# EAGLE design Breakout board ESP8266-012F HW 2.0 Rev. 1 (EAGLE 8.2.1)
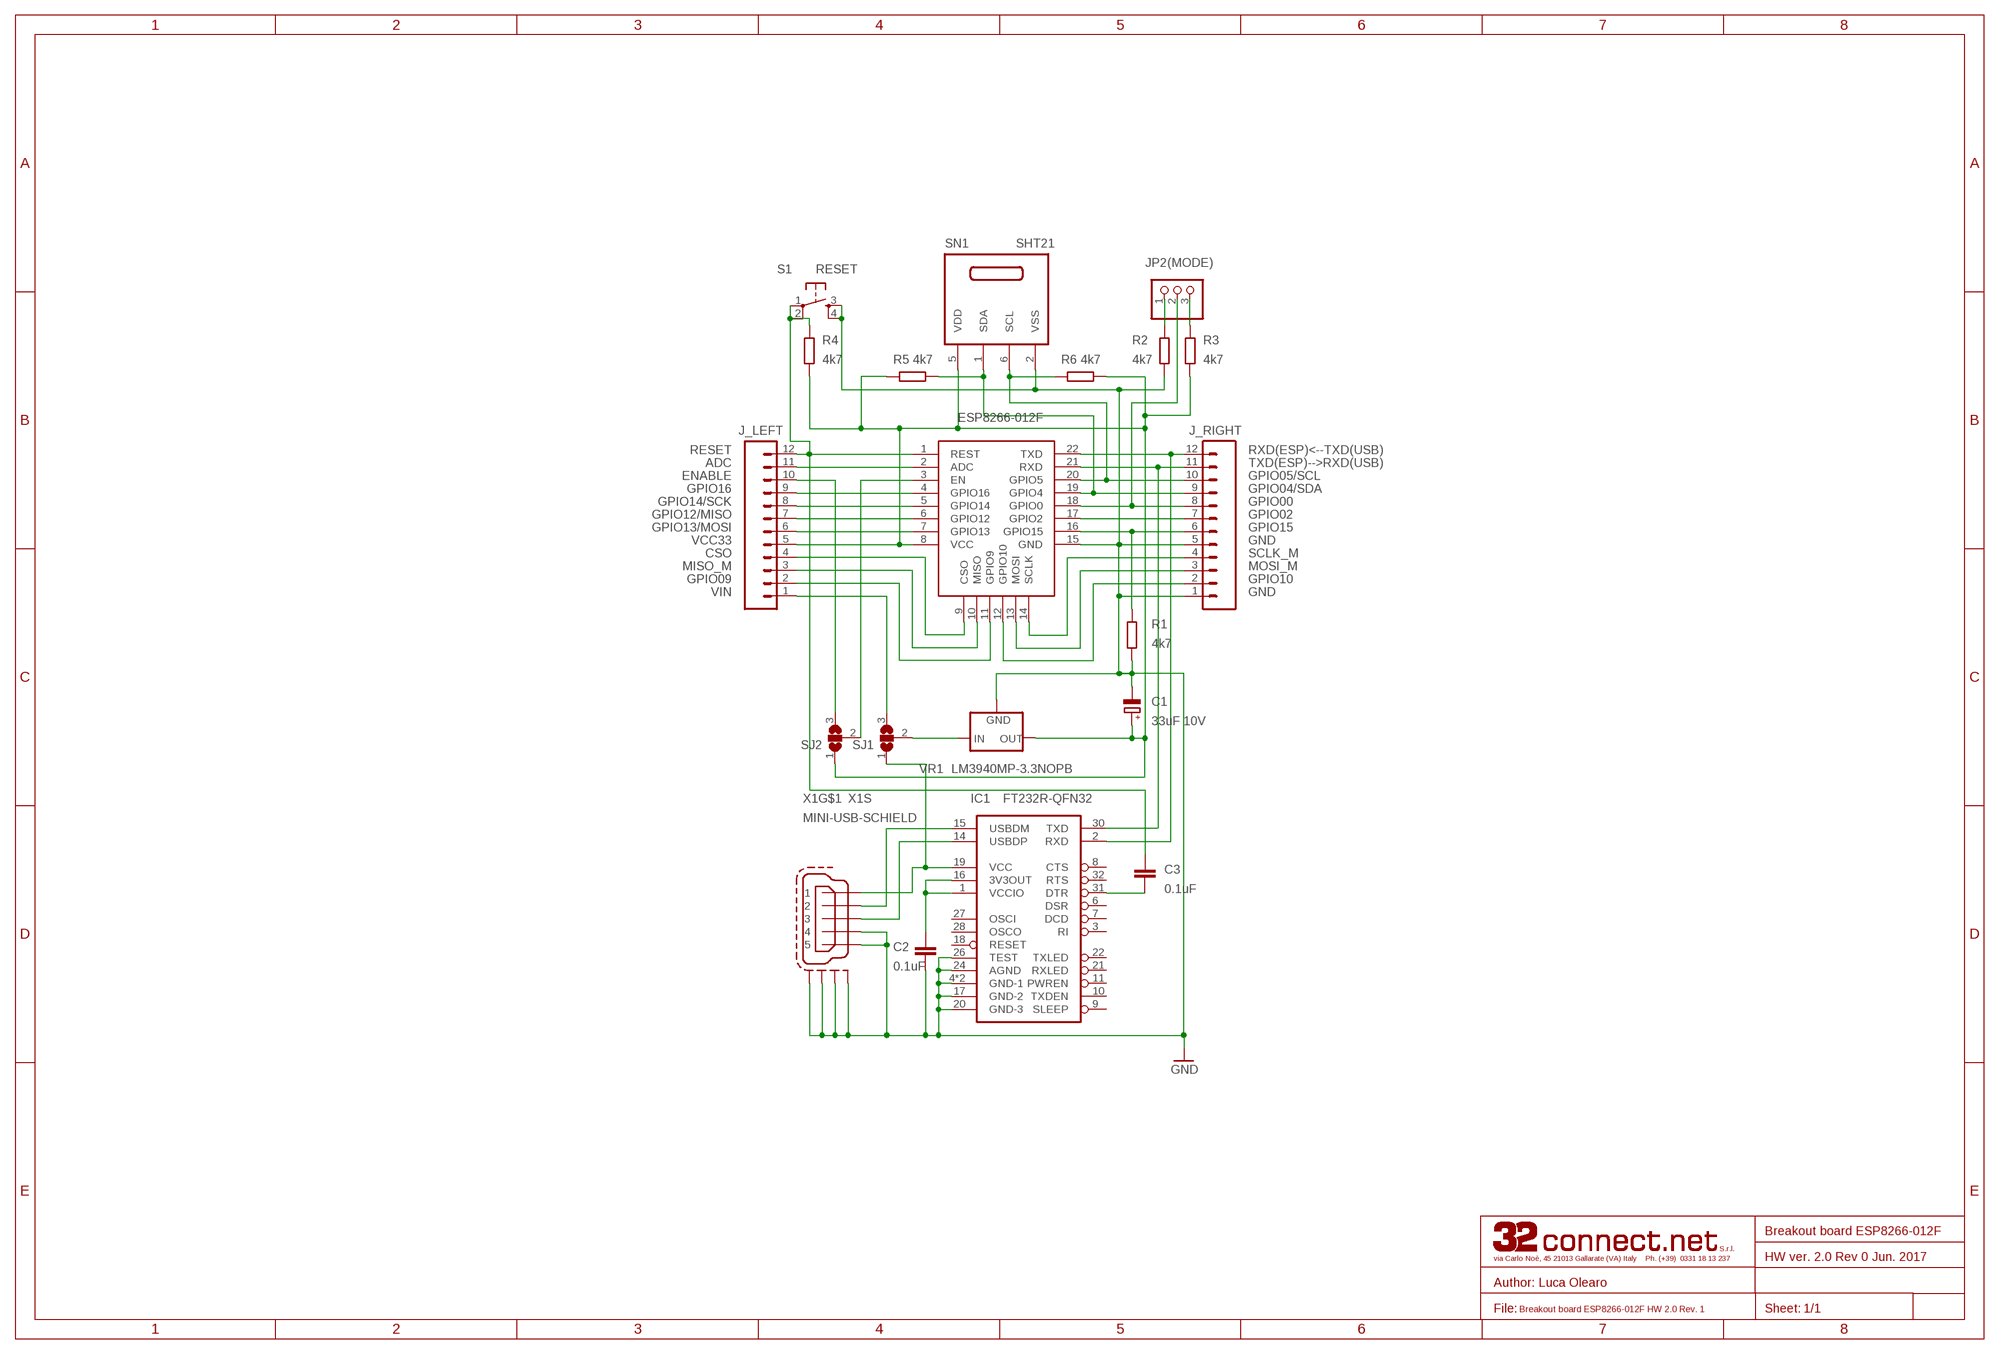
[diagram p0: schematic, sheet 1]

## Parts
C1  33uF 10V  CPOL-EUUD-5X5,8  [UD-5X5,8_NICHICON]
C2  0.1uF  C-EUC0805  [C0805]
C3  0.1uF  C-EUC0805  [C0805]
IC1  FT232R-QFN32  [QFN32]
J_LEFT  M12LONGPADS  [1X12_LONGPADS]
J_RIGHT  M12LONGPADS  [1X12_LONGPADS]
JP2(MODE)  PINHD-1X3  [1X03]
MDL1  ESP8266-012F  ESP8266-12GPIO04/05_CORRECTED  [ESP8266-ESP12]
R1  4k7  R-EU_R0805  [R0805]
R2  4k7  R-EU_R0805  [R0805]
R3  4k7  R-EU_R0805  [R0805]
R4  4k7  R-EU_R0805  [R0805]
R5  4k7  R-EU_R0805  [R0805]
R6  4k7  R-EU_R0805  [R0805]
S1  RESET  TAC_SWITCH4  [C&K_KMS]
SJ1  SJ2W  [SJ_2]
SJ2  SJ2W  [SJ_2]
SN1  SHT21  [DFN6/SHT]
VR1  LM3940MP-3.3NOPB  [SOT223]
X1  MINI-USB-SCHIELD  MINI-USB-SCHIELD--  [MOLEX_67503-X20]

## Nets
ADC: J_LEFT.11 MDL1.2(ADC)
CSO: J_LEFT.4 MDL1.9(CSO)
D+: IC1.14(USBDP) X1.3
D-: IC1.15(USBDM) X1.2
ENABLE: J_LEFT.10 SJ2.3
GND: C1.- C2.2 IC1.4(GND-1) IC1.17(GND-2) IC1.20(GND-3) IC1.24(AGND) IC1.26(TEST) IC1.EXP(GND-1) J_RIGHT.1 J_RIGHT.5 MDL1.15(GND) R1.2 R2.2 S1.3 S1.4 SN1.2(VSS) VR1.2(GND) VR1.4(GND) X1.4 X1.5 X1.M1(S:S1) X1.M2(S:S2) X1.M3(S:S3) X1.M4(S:S4)
GPIO00: J_RIGHT.8 JP2(MODE).2 MDL1.18(GPIO0)
GPIO02: J_RIGHT.7 MDL1.17(GPIO2)
GPIO04/SDA: J_RIGHT.9 MDL1.19(GPIO4) R5.2 SN1.1(SDA)
GPIO05/SCL: J_RIGHT.10 MDL1.20(GPIO5) R6.1 SN1.6(SCL)
GPIO09: J_LEFT.2 MDL1.11(GPIO9)
GPIO10: J_RIGHT.2 MDL1.12(GPIO10)
GPIO12/MISO: J_LEFT.7 MDL1.6(GPIO12)
GPIO13/MOSI: J_LEFT.6 MDL1.7(GPIO13)
GPIO14/SCK: J_LEFT.8 MDL1.5(GPIO14)
GPIO15: J_RIGHT.6 MDL1.16(GPIO15) R1.1
GPIO16: J_LEFT.9 MDL1.4(GPIO16)
MISO_M: J_LEFT.3 MDL1.10(MISO)
MOSI_M: J_RIGHT.3 MDL1.13(MOSI)
N$2: SJ1.2 VR1.1(IN)
N$3: C3.2 IC1.31(DTR)
N$4: MDL1.3(EN) SJ2.2
N$6: C2.1 IC1.1(VCCIO) IC1.16(3V3OUT)
N$9: JP2(MODE).3 R3.1
N$10: JP2(MODE).1 R2.1
RESET: C3.1 J_LEFT.12 MDL1.1(REST) R4.1 S1.1 S1.2
RXD(ESP)<--TXD(USB): IC1.2(RXD) J_RIGHT.12 MDL1.22(TXD)
SCLK_M: J_RIGHT.4 MDL1.14(SCLK)
TXD(ESP)-->RXD(USB): IC1.30(TXD) J_RIGHT.11 MDL1.21(RXD)
VBUS: IC1.19(VCC) SJ1.1 X1.1
VCC33: C1.+ J_LEFT.5 MDL1.8(VCC) R3.2 R4.2 R5.1 R6.2 SJ2.1 SN1.5(VDD) VR1.3(OUT)
VIN: J_LEFT.1 SJ1.3
Unconnected: IC1.3(RI) IC1.6(DSR) IC1.7(DCD) IC1.8(CTS) IC1.9(SLEEP) IC1.10(TXDEN) IC1.11(PWREN) IC1.18(RESET) IC1.21(RXLED) IC1.22(TXLED) IC1.27(OSCI) IC1.28(OSCO) IC1.32(RTS)

## Notes on the sheet
- Breakout board ESP8266-012F
- HW ver. 2.0 Rev 0 Jun. 2017

## Library data of the parts
C1 = rcl:CPOL-EU: POLARIZED CAPACITOR, European symbol
C2 C3 = rcl:C-EU: CAPACITOR, European symbol
IC1 = Multiconnect_base:FT232R: USB UART FT232RL 4th Generation USB UART (USB <-> Serial) Controller. Spark Fun Electronics SKU : COM-00650 Production SKU IC-00870
J_LEFT J_RIGHT = SparkFun-Connectors:M12: Header 12 Standard 12-pin 0.1" header. Use with straight break away headers (SKU : PRT-00116), right angle break away headers (PRT-00553), swiss pins (PRT-00743), machine pins (PRT-00117), and female headers (PRT-00115).
JP2(MODE) = pinhead:PINHD-1X3: PIN HEADER
MDL1 = ESP8266 EAGLE LIBRARY:ESP8266-12: Espressif ESP8266 ESP-12 Module with GPIO04 and GPIO05 corrected.
R1-R6 = rcl:R-EU_: RESISTOR, European symbol
S1 = Multiconnect_base:TAC_SWITCH: Momentary Switch
SJ1 SJ2 = Multiconnect_base:SJ2W: SMD solder JUMPER
SN1 = sensirion:SHT21: Humidity and Temperature Sensor
VR1 = Multiconnect_base:LM3940MP-3.3NOPB: MIC2920A (http://www.micrel.com/_PDF/mic2920.pdf) - 400mA output LDO Regulator
X1 = con-cypressindustries:MINI-USB-SCHIELD-: MINI USB-B Conector Source: www.cypressindustries.com

## Net classes
0 default: width 0.203 mm, clearance 0.152 mm

## Board
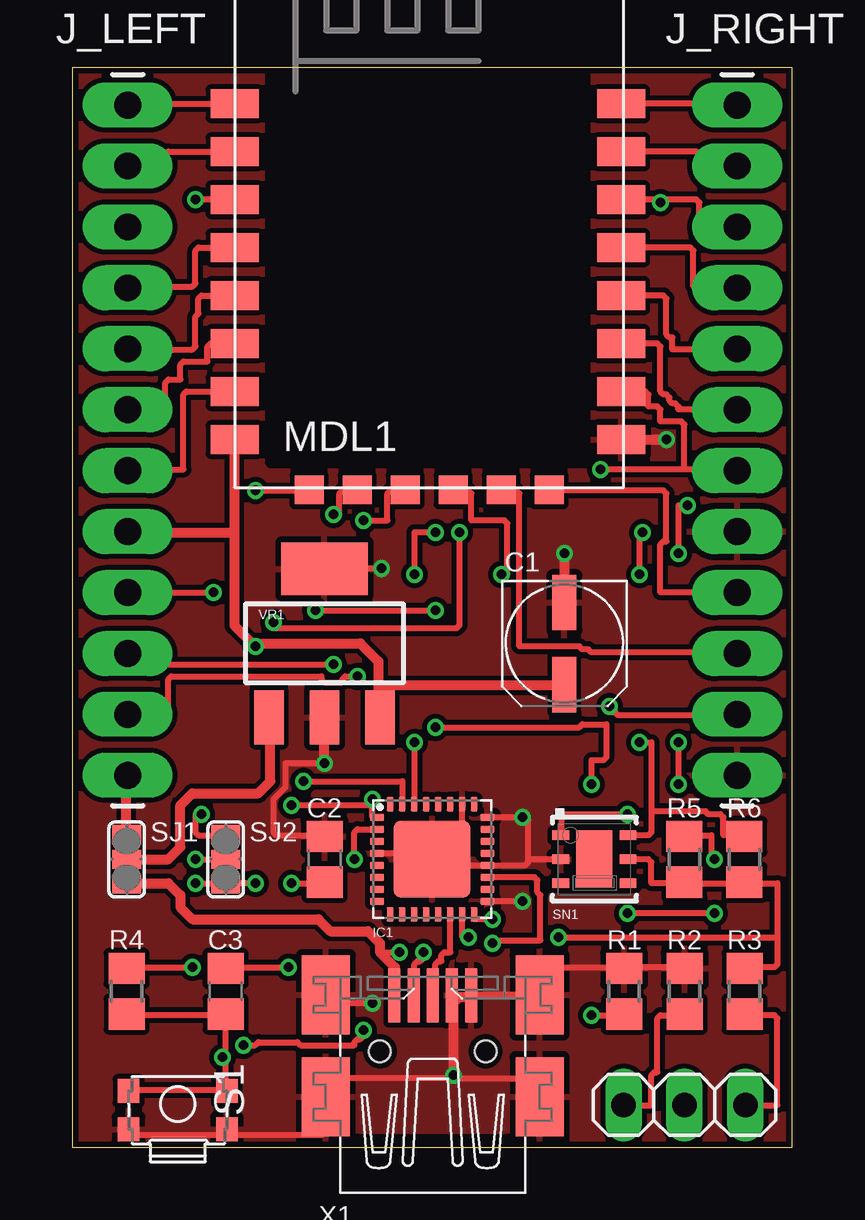
[diagram p1: board, top side]
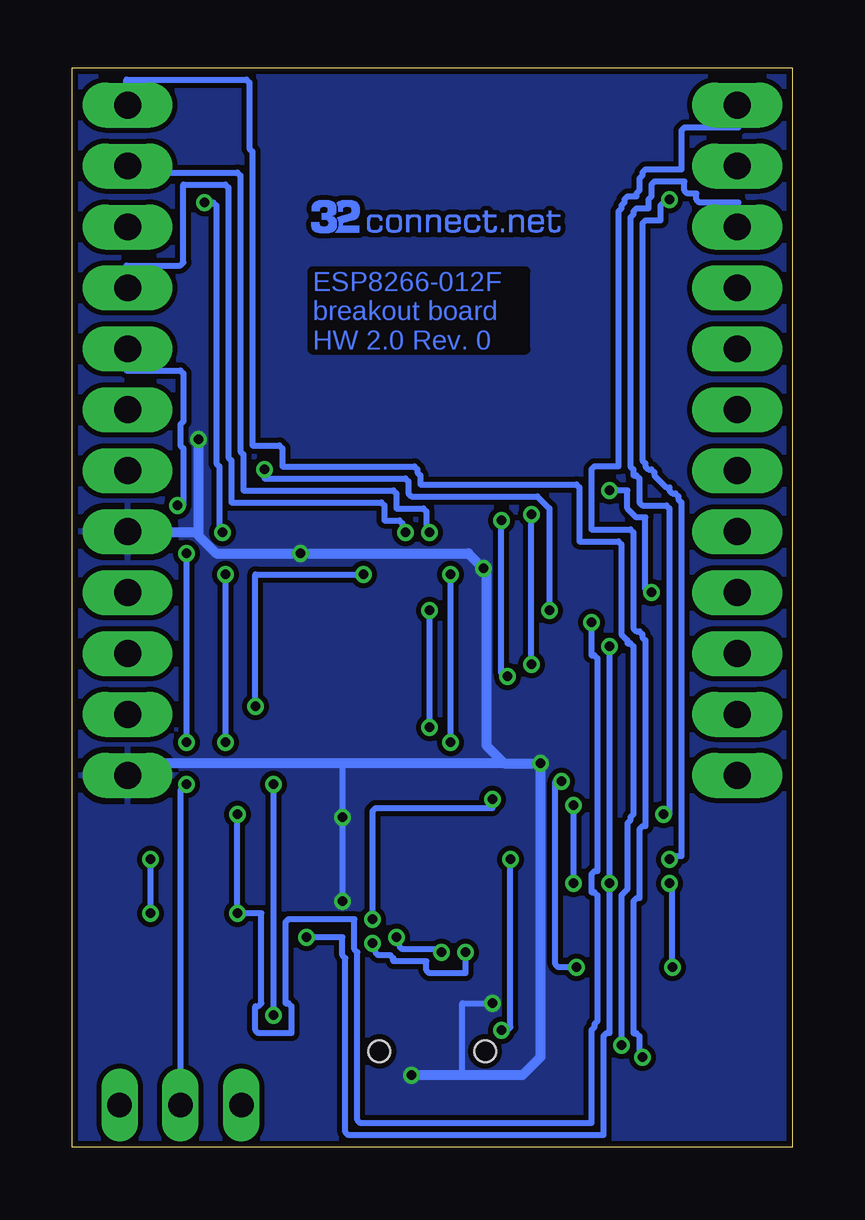
[diagram p2: board, bottom side, seen from below]

Size 30 x 45 mm. Coordinates in mm from the lower left corner, seen from the top.
Outline: 30,0 30,45 0,45 0,0 30,0
Copper layers (1*16): Top 0.035mm / dielectric 1.5mm / Bottom 0.035mm
Design rules "default *": minimum track width 10mil, minimum drill 0.4mm, track to track 8mil, track to pad 8mil, pad to pad 8mil, via to via 8mil, smd to smd 8mil, copper to edge 10mil, drill to drill 8mil, minimum pad ring 8mil, minimum via ring 6mil, stop-mask expansion 4mil, vias tented up to drill 0mil, thermal gap 10mil
tRestrict: area 8.2,28.5 to 21.4,44.9

### Footprints (pad centres in the part's own frame; a part is rotated, then mirrored left to right if it is on the bottom)
UD-5X5,8_NICHICON = smd 2.3 x 1: + 1.725,0; - -1.7,0
C0805 = smd 1.3 x 1.5: 1 -0.95,0; 2 0.95,0
QFN32 = smd 0.6 x 0.3: 1 -2.3,1.75; 2 -2.3,1.25; 3 -2.3,0.75; 4 -2.3,0.25; 5 -2.3,-0.25; 6 -2.3,-0.75; 7 -2.3,-1.25; 8 -2.3,-1.75; 17 2.3,-1.75; 18 2.3,-1.25; 19 2.3,-0.75; 20 2.3,-0.25; 21 2.3,0.25; 22 2.3,0.75; 23 2.3,1.25; 24 2.3,1.75 | smd 0.3 x 0.6: 9 -1.75,-2.3; 10 -1.25,-2.3; 11 -0.75,-2.3; 12 -0.25,-2.3; 13 0.25,-2.3; 14 0.75,-2.3; 15 1.25,-2.3; 16 1.75,-2.3; 25 1.75,2.3; 26 1.25,2.3; 27 0.75,2.3; 28 0.25,2.3; 29 -0.25,2.3; 30 -0.75,2.3; 31 -1.25,2.3; 32 -1.75,2.3 | smd 3.2 x 3.2: EXP 0,0
1X12_LONGPADS = drill 1.118 pad 1.88 long: 1 0,0; 2 2.54,0; 3 5.08,0; 4 7.62,0; 5 10.16,0; 6 12.7,0; 7 15.24,0; 8 17.78,0; 9 20.32,0; 10 22.86,0; 11 25.4,0; 12 27.94,0
1X03 = drill 1.016 long: 1 -2.54,0; 2 0,0; 3 2.54,0
ESP8266-ESP12 = smd 2 x 1.2: 1 0,16; 2 0,14; 3 0,12; 4 0,10; 5 0,8; 6 0,6; 7 0,4; 8 0,2; 15 16.1,2; 16 16.1,4; 17 16.1,6; 18 16.1,8; 19 16.1,10; 20 16.1,12; 21 16.1,14; 22 16.1,16 | smd 1.2 x 1.2: 9 3.1,-0.1; 10 5.1,-0.1; 11 7.1,-0.1; 12 9.1,-0.1; 13 11.1,-0.1; 14 13.1,-0.1
R0805 = smd 1.3 x 1.5: 1 -0.95,0; 2 0.95,0
C&K_KMS = smd 0.9 x 1: 1 0.45,2.1; 2 4.55,2.1; 3 0.45,0.5; 4 4.55,0.5
SJ_2 = smd 0.8 x 1.2: 1 -1.024,0; 2 0,0; 3 1.024,0
DFN6/SHT = smd 0.4 x 0.7: 1 -1,-1.4; 2 0,-1.4; 3 1,-1.4; 4 1,1.4; 5 0,1.4; 6 -1,1.4 | smd 2.4 x 1.5: NC 0,0
SOT223 = smd 1.219 x 2.235: 1 -2.311,-3.099; 2 0,-3.099; 3 2.311,-3.099 | smd 3.6 x 2.2: 4 0,3.099
MOLEX_67503-X20 = smd 2.25 x 0.5: 1 2.325,1.6; 2 2.325,0.8; 3 2.325,0; 4 2.325,-0.8; 5 2.325,-1.6 | smd 3.3 x 2: M1 -1.9,-4.45; M2 -1.9,4.45; M3 2.35,4.45; M4 2.35,-4.45 | hole 0.9: 0,2.2; 0,-2.2

### Placement (x,y rotation side)
C1  20.5,21 270 top
C2  10.51,12 90 top
C3  6.38,6.5 90 top
IC1  14.99,12 0 top
J_LEFT  2.3,15.5 90 top
J_RIGHT  27.7,15.5 90 top
JP2(MODE)  25.5,1.76 0 top
MDL1  6.76,27.5 0 top
R1  22.99,6.5 90 top
R2  25.51,6.5 90 top
R3  28.01,6.5 90 top
R4  2.26,6.5 90 top
R5  25.5,12 90 top
R6  28,12 270 top
S1  1.89,0.25 0 top
SJ1  2.26,12 90 top
SJ2  6.38,12 90 top
SN1  21.75,12 270 top
VR1  10.5,21.01 0 top
X1  15.01,4 90 top

### Tracks (layer width: path | path; a pad name or v marks a point on that pad's centre or on a via)
ADC
  Top 0.254: MDL1.2 4,41.5 3.88,41.38 3.88,40.88 2.38,40.88 J_LEFT.11
CSO  (via drill 0.4)
  Top 0.254: v7.62,27.38 9.75,27.38 MDL1.9 | v5.88,23.12 2.38,23.12 J_LEFT.4
  Bottom 0.254: v7.62,27.38 6.88,27.38 6.88,26.62 6.5,26.25 6.12,26.25 6.12,23.25 6,23.12 v5.88,23.12
D+
  Top 0.254: IC1.14 15.75,9.62 15.75,8.12 15.5,8.12 15.38,8 15.38,7.75 15.25,7.75 15.12,7.62 15.12,7.25 15,7.12 15,6.38 X1.3
D-  (via drill 0.4)
  Top 0.254: v16.5,8.75 16.25,8.75 16.25,9.62 IC1.15 | v14.62,8.12 14.62,7.88 14.5,7.75 14.38,7.75 14.25,7.62 14.25,6.38 X1.2
  Bottom 0.254: v16.5,8.75 16.38,8.62 16.38,8.38 16.25,8.25 14.62,8.25 v14.62,8.12
ENABLE  (via drill 0.4)
  Top 0.254: v5.38,13.88 5.12,13.88 5.12,13.12 5.25,13 6.38,13 SJ2.3
  Bottom 0.254: v5.38,13.88 5.12,13.88 5.12,26.62 5.25,26.75 6.25,26.75 6.38,26.88 6.38,27.88 6.5,28 6.62,28 6.62,28.25 6.75,28.38 6.75,38.75 6.62,38.88 6.62,39 6.5,39.12 6,39.12 6,39.5 5.88,39.62 5.88,40.12 5.75,40.25 4.5,40.25 4.5,39.88 4.38,39.75 4,39.75 4,39.5 3.88,39.38 2.25,39.38 2.25,38.38 J_LEFT.10
GND  (via drill 0.4)
  Top 0.254: S1.3 2.38,0.75 2.38,0.5 6.38,0.5 6.38,0.75 S1.4 6.5,0.5 10.38,0.5 10.5,0.62 10.5,2 X1.M2 10.5,2.12 10.5,2.88 15.75,2.88 v15.88,3 16,2.88 19.5,2.88 19.5,2.12 X1.M1 | R2.2 25.5,7.5 23,7.5 R1.2 22.88,7.5 19.62,7.5 19.5,7.38 19.5,6.38 X1.M4 19.38,6.38 16.75,6.38 X1.5 16.62,6.38 16.5,6.25 | IC1.24 v18.75,13.75 18.88,13.75 19,13.62 19,12 | SN1.2 19,12 | IC1.4 13.88,12.25 14,12.12 14,12 IC1.EXP | IC1.EXP 16.25,12 16.25,14.25 IC1.26 | IC1.EXP 16.25,11.88 16.38,11.75 IC1.20 18.88,11.75 19,11.88 19,12 | v18.75,10.25 IC1.17 | v10.5,16 8.88,16 8.88,15 8.38,14.5 8.38,13.12 8.5,13 10.5,13 C2.2 | MDL1.15 22.88,29.5 23,29.5 | X1.4 15.88,6.25 16,6.12 | 20.5,22.75 C1.- | v12.5,6 10.5,6 10.5,6.25 X1.M3 | v12.88,24.12 10.5,24.12 VR1.4
  Top 0.406: 23,29.5 v24.75,29.5 | v10.5,16 10.5,17.88 VR1.2 10.5,18 | v20.5,24.75 20.5,22.75 | 16.5,6.25 16.12,6.25 16,6.12 15.88,6 v15.88,3
  Bottom 0.254: 18.75,16 v18.75,13.75 v18.75,10.25 | v15.88,3 15.75,3 | v12.5,6 13.75,6 13.75,3 | J_RIGHT.5 27.75,25.75 27.75,25.62
  Bottom 0.406: v24.75,29.5 24.75,25.62 | 24.75,25.62 24.75,25.5 24,24.75 v20.5,24.75 13.5,24.75 v12.88,24.12 12.75,24 12.75,16.75 12,16 | 12,16 v10.5,16 10.5,3.75 11.25,3 13.75,3 15.75,3 | 24.75,25.62 27.75,25.62 | 12,16 18.75,16 27.2,16 J_RIGHT.1
  pour Top: 0,45 30,45 30,0 0,0
  pour Bottom: 0,45 30,45 30,0 0,0
GPIO00  (via drill 0.4)
  Top 0.254: MDL1.18 24.62,35.5 24.75,35.38 24.75,33.88 24.88,33.75 25,33.75 25,33.25 27.62,33.25 J_RIGHT.8 | v25.25,16.88 v25.25,15.12 | v25.25,24.75 25.25,26.75 v25.62,26.75
  Bottom 0.254: JP2(MODE).2 25.5,14.88 25.38,15 25.25,15 v25.25,15.12 | v25.25,24.75 v25.25,16.88 | v25.62,26.75 25.38,26.75 25.38,29.12 25.5,29.25 25.5,30.12 25.38,30.25 25.38,32.25 25.5,32.38 27.75,32.38 27.75,33.25 J_RIGHT.8
GPIO02
  Top 0.254: MDL1.17 24.38,33.5 24.5,33.38 24.5,31.5 24.62,31.38 24.75,31.38 24.88,31.25 24.88,31.12 25,31 25.12,31 25.25,30.88 25.25,30.75 27.62,30.75 J_RIGHT.7
GPIO04/SDA  (via drill 0.4)
  Top 0.254: v23.12,13.88 20.38,13.88 20.38,13 SN1.1 | v26.75,9.75 v23.12,9.75 | v26.75,12 26.62,12.12 26.62,13 25.5,13 R5.2 | MDL1.19 25.75,37.5 25.88,37.38 25.88,35.88 27.62,35.88 J_RIGHT.9 | v8.38,21.88 8.38,21.62 16,21.62 16.12,21.75 v16.12,25.62
  Bottom 0.254: v23.12,13.88 v23.12,9.75 22.12,9.75 22.12,6 22.25,5.88 22.38,5.88 22.38,4.88 22.25,4.75 20.88,4.75 20.88,5.88 21,6 21.12,6 21.12,9.38 21,9.5 18.25,9.5 18.25,8.25 18.12,8.12 18.12,1.12 18,1 8.38,1 8.38,4.88 8.25,5 8.25,5.12 8.12,5.25 8.12,10.5 8.25,10.62 8.38,10.62 8.38,11.38 8.25,11.5 8.12,11.5 8.12,20.38 8.25,20.5 8.38,20.5 v8.38,21.88 | v26.75,12 v26.75,9.75 | v16.12,25.62 16.25,25.75 16.25,26 16.38,26.12 17,26.12 17,26.75 17.12,26.88 23.38,26.88 23.38,28.62 23.5,28.75 23.5,40 23.62,40.12 25.38,40.12 25.38,36.88 25.5,36.75 27.75,36.75 27.75,35.88 J_RIGHT.9
GPIO05/SCL  (via drill 0.4)
  Top 0.254: SN1.6 24,13 24.12,13.12 24.12,14 | 24.12,14 26.38,14 26.5,13.88 27,13.88 27.12,13.75 27.12,13 28,13 R6.1 | 24.5,39.5 26,39.5 26.12,39.38 26.12,38.38 27.62,38.38 J_RIGHT.10 | 24.5,39.5 MDL1.20 | 24.12,14 24.12,16.88 v23.62,16.88 | v23.62,23.88 23.62,25.62 v23.75,25.62 | v24.5,39.38 24.5,39.5
  Bottom 0.254: v23.62,23.88 v23.62,16.88 | v23.75,25.62 23.88,25.75 23.88,28.38 24,28.5 24,39.25 24.12,39.38 v24.5,39.38
GPIO09  (via drill 0.4)
  Top 0.254: v12.12,26.12 13.12,26.12 13.12,27.25 13.25,27.38 13.75,27.38 MDL1.11 | v11.88,19.62 11.38,19.62 11.25,19.5 11.25,19.38 10.5,19.38 10.38,19.5 10.38,19.62 4.12,19.62 4,19.5 4,18 2.38,18 J_LEFT.2
  Bottom 0.254: v12.12,26.12 12.12,19.75 12,19.62 v11.88,19.62
GPIO10  (via drill 0.4)
  Top 0.254: v17.88,23.88 18.12,23.88 18.12,26 18,26.12 16.62,26.12 16.62,27.25 16.5,27.38 15.88,27.38 MDL1.12 | v22.38,18.38 22.38,18.12 22.62,18.12 22.75,18 27.62,18 J_RIGHT.2
  Bottom 0.254: v17.88,23.88 22.38,23.88 v22.38,18.38
GPIO12/MISO
  Top 0.254: MDL1.6 5.75,33.5 5.62,33.38 5.62,32.75 4.62,32.75 4.5,32.62 4.5,32 4,32 3.88,31.88 3.88,30.75 2.38,30.75 J_LEFT.7
GPIO13/MOSI
  Top 0.254: MDL1.7 4.75,31.5 4.62,31.38 4.62,28.25 2.38,28.25 J_LEFT.6
GPIO14/SCK
  Top 0.254: MDL1.5 5.38,35.5 5.25,35.38 5.25,34.75 5.12,34.62 5.12,33.38 5,33.25 2.38,33.25 J_LEFT.8
GPIO15  (via drill 0.4)
  Top 0.254: v21.62,5.5 22.88,5.5 R1.1 | v21.62,15.12 21.62,16.12 22.12,16.12 22.25,16.25 22.25,17.62 21.25,17.62 21.12,17.5 v15.12,17.5 | v10.12,22.38 v15.12,22.38 | 25.5,28.25 27.62,28.25 J_RIGHT.6 | 25.5,28.25 v22,28.25 | MDL1.16 23.88,31.5 24,31.38 24,30.88 24.38,30.88 24.5,30.75 24.5,30.25 25.38,30.25 25.5,30.12 25.5,28.25
  Bottom 0.254: v21.62,15.12 v21.62,5.5 | v15.12,22.38 v15.12,17.5 | v10.12,22.38 10.12,26.62 10.62,27.12 15.88,27.12 16,27.25 16,27.75 16.12,27.88 22,27.88 v22,28.25
GPIO16
  Top 0.254: MDL1.4 5.25,37.5 5.12,37.38 5.12,36 5,35.88 2.38,35.88 J_LEFT.9
MISO_M  (via drill 0.4)
  Top 0.254: v10.88,26.38 11.12,26.38 11.12,27.25 11.25,27.38 11.75,27.38 MDL1.10 | v10.88,20.12 4,20.12 3.88,20.25 3.88,20.62 2.38,20.62 J_LEFT.3
  Bottom 0.254: v10.88,20.12 v10.88,26.38
MOSI_M
  Top 0.254: MDL1.13 17.88,27.38 18.5,27.38 18.62,27.25 18.62,20.88 21.12,20.88 21.25,20.75 21.5,20.75 21.62,20.62 27.62,20.62 J_RIGHT.3
N$2
  Top 0.254: 8.25,17.88 VR1.1
  Top 0.406: SJ1.2 4,12 4.5,12.5 4.5,14.25 5,14.75 7.75,14.75 8.25,15.25 8.25,17.88 8.25,18
N$3  (via drill 0.4)
  Top 0.254: v9.62,15.25 13.75,15.25 13.75,14.38 IC1.31 | v9,7.5 6.5,7.5 C3.2
  Bottom 0.254: v9.62,15.25 9.88,15.25 9.88,7.62 9.75,7.5 v9,7.5
N$4  (via drill 0.4)
  Top 0.254: v5.12,12 SJ2.2 | MDL1.3 v5.12,39.5
  Bottom 0.254: v5.12,12 5,12.12 4.62,12.12 4.62,26.88 4.75,27 4.75,27.12 4.88,27.25 5,27.25 5.12,27.38 5.12,27.5 5.25,27.5 5.75,28 5.75,28.12 5.88,28.25 6,28.25 6.12,28.38 6.12,28.5 6.25,28.62 6.25,38.5 6.12,38.62 5.5,38.62 5.5,39.25 5.38,39.38 5.12,39.38 v5.12,39.5
N$6  (via drill 0.4)
  Top 0.254: v17.5,9.5 16.75,9.5 16.75,9.62 IC1.16 | IC1.1 12.5,13.75 v12.5,14.5 12.38,14.25 v9.12,14.25 | v9.12,11 10.5,11 C2.1
  Bottom 0.254: v17.5,9.5 17.5,14 17.38,14.12 12.5,14.12 v12.5,14.5 | v9.12,14.25 v9.12,11
N$9
  Top 0.254: R3.1 28.12,5.5 29.25,5.5 29.38,5.38 29.38,1.75 28.12,1.75 JP2(MODE).3
N$10
  Top 0.254: R2.1 25.5,5.5 24.5,5.5 24.38,5.38 24.38,3.12 24.25,3.12 24.12,3 24.12,1.75 23,1.75 JP2(MODE).1
RESET  (via drill 0.4)
  Top 0.254: S1.1 2.38,2.38 6.25,2.38 6.38,2.5 6.5,2.38 S1.2 6.38,2.62 6.38,3.75 | R4.1 2.38,5.5 6.38,5.5 C3.1 6.38,5.38 6.38,3.75 | MDL1.1 2.38,43.5 J_LEFT.12 | v6.25,3.75 6.38,3.75
  Bottom 0.254: v6.25,3.75 6.38,3.88 6.38,4.62 6.5,4.75 6.62,4.75 6.62,10.25 6.5,10.38 6.38,10.38 6.38,13.25 6.25,13.38 6.12,13.38 6.12,21.12 6.25,21.25 6.25,21.38 6.38,21.5 6.5,21.5 6.62,21.62 6.62,25.62 6.75,25.75 8.38,25.75 8.38,28.25 8.25,28.38 7.25,28.38 7.25,39 7.12,39.12 7.12,39.25 7,39.38 7,39.5 6.88,39.62 6.5,39.62 6.5,39.75 6.38,39.88 6.38,40.38 6.25,40.5 6.25,40.62 6.12,40.75 4.62,40.75 4.62,42.38 4.5,42.5 2.25,42.5 2.25,43.38 J_LEFT.12
RXD(ESP)<--TXD(USB)  (via drill 0.4)
  Top 0.254: IC1.2 11.88,13.25 11.75,13.12 v11.75,12 | v12.12,4.88 12.12,4.62 12,4.5 11.88,4.5 11.75,4.38 11.75,4.25 9.5,4.25 9.38,4.38 7.75,4.38 7.62,4.25 v7.12,4.25 | MDL1.22 27.62,43.5 J_RIGHT.12
  Bottom 0.254: v11.75,12 11.75,5 11.88,4.88 v12.12,4.88 | v7.12,4.25 7.12,10.5 6.88,10.75 6.88,13.5 6.75,13.62 6.75,13.75 6.62,13.88 6.62,20.88 6.75,21 6.88,21 6.88,21.12 7.12,21.38 7.12,25.12 7.25,25.25 8.88,25.25 8.88,27.5 9,27.62 15.5,27.62 15.5,28 15.62,28.12 15.62,28.25 15.75,28.38 21.25,28.38 21.25,29.12 21.38,29.25 22.5,29.25 22.5,41.5 22.62,41.62 22.62,44.38 22.75,44.5 27.75,44.5 27.75,43.5 J_RIGHT.12
SCLK_M
  Top 0.254: MDL1.14 19.88,27.38 24.62,27.38 24.75,27.25 24.75,25.25 24.62,25.25 24.5,25.12 24.5,23.12 27.62,23.12 J_RIGHT.4
TXD(ESP)-->RXD(USB)  (via drill 0.4)
  Top 0.254: v14.25,16.88 14.25,14.38 IC1.30 | v14.25,23.88 14.25,25.62 v15.12,25.62 | MDL1.21 26,41.5 26.12,41.38 26.12,40.88 27.62,40.88 J_RIGHT.11
  Bottom 0.254: v14.25,23.88 v14.25,16.88 | v15.12,25.62 15.25,25.75 15.25,26.5 15.38,26.62 16.5,26.62 16.5,27.25 16.62,27.38 22.88,27.38 22.88,28.88 23,29 23,40.5 23.12,40.62 27.75,40.62 27.75,40.88 J_RIGHT.11
VBUS  (via drill 0.4)
  Top 0.254: IC1.19 19.25,11.25 19.38,11.12 19.38,10.62 19.5,10.5 19.5,8.62 17.62,8.62 v17.5,8.5 | 12.81,8.12 v13.62,8.12 | 2.25,11 SJ1.1 | X1.1 13.5,6.38 13.44,6.5
  Top 0.406: 2.25,11 4,11 4.5,10.5 4.5,10 5,9.5 10.25,9.5 10.75,9 12.31,9 12.81,8.5 12.81,8.12 13.44,7.5 13.44,6.5
  Bottom 0.254: v17.5,8.5 17.38,8.38 17.38,8.12 17.25,8 16.75,8 16.62,7.88 16.62,7.75 15.25,7.75 15.25,7.38 15.12,7.25 13.62,7.25 v13.62,8.12
VCC33  (via drill 0.4)
  Top 0.254: SN1.5 24,12 24.12,11.88 24.12,11 25.5,11 R5.1 25.62,11 28,11 R6.2 28.12,11 29.38,11 29.38,8.75 | 29.38,8.75 29.38,7.62 29.25,7.5 28.12,7.5 R3.2 | v5.12,11 6.38,11 SJ2.1 6.5,11 v7.62,11 | v5,7.5 2.38,7.5 R4.2 | 6.88,29.5 MDL1.8 | 2.38,25.62 J_LEFT.5 | VR1.3 12.88,17.88 12.75,18 | 20.5,19.25 C1.+ | v7.62,20.88 7.5,21 | v20.25,8.75 29.38,8.75
  Top 0.406: MDL1.8 6.75,25.62 | 6.75,25.62 6.75,21.75 7.5,21 12,21 12.75,20.25 12.75,19.25 | 12.75,19.25 12.75,18 | 20.5,19.25 12.75,19.25 | 2.25,25.62 2.38,25.62 6.75,25.62
  Bottom 0.254: v5.12,11 5,10.88 v5,7.5 | v7.62,20.88 v7.62,11 7.62,4.75 7.75,4.75 7.88,4.62 7.88,0.5 18.5,0.5 18.62,0.62 18.62,7.88 18.75,8 18.75,8.75 v20.25,8.75
VIN
  Top 0.254: 2.25,13.12 SJ1.3 | 2.25,15.5 J_LEFT.1
  Top 0.406: 2.25,13 2.25,13.12 2.25,15.5
(copper drawn outside any net)
  shapes: Bottom area x27617

### Text on the board
Bottom: ESP8266-012F / breakout board / HW 2.0 Rev. 0